# EAGLE design arm-pro-mini-tester (EAGLE 6.5.0)
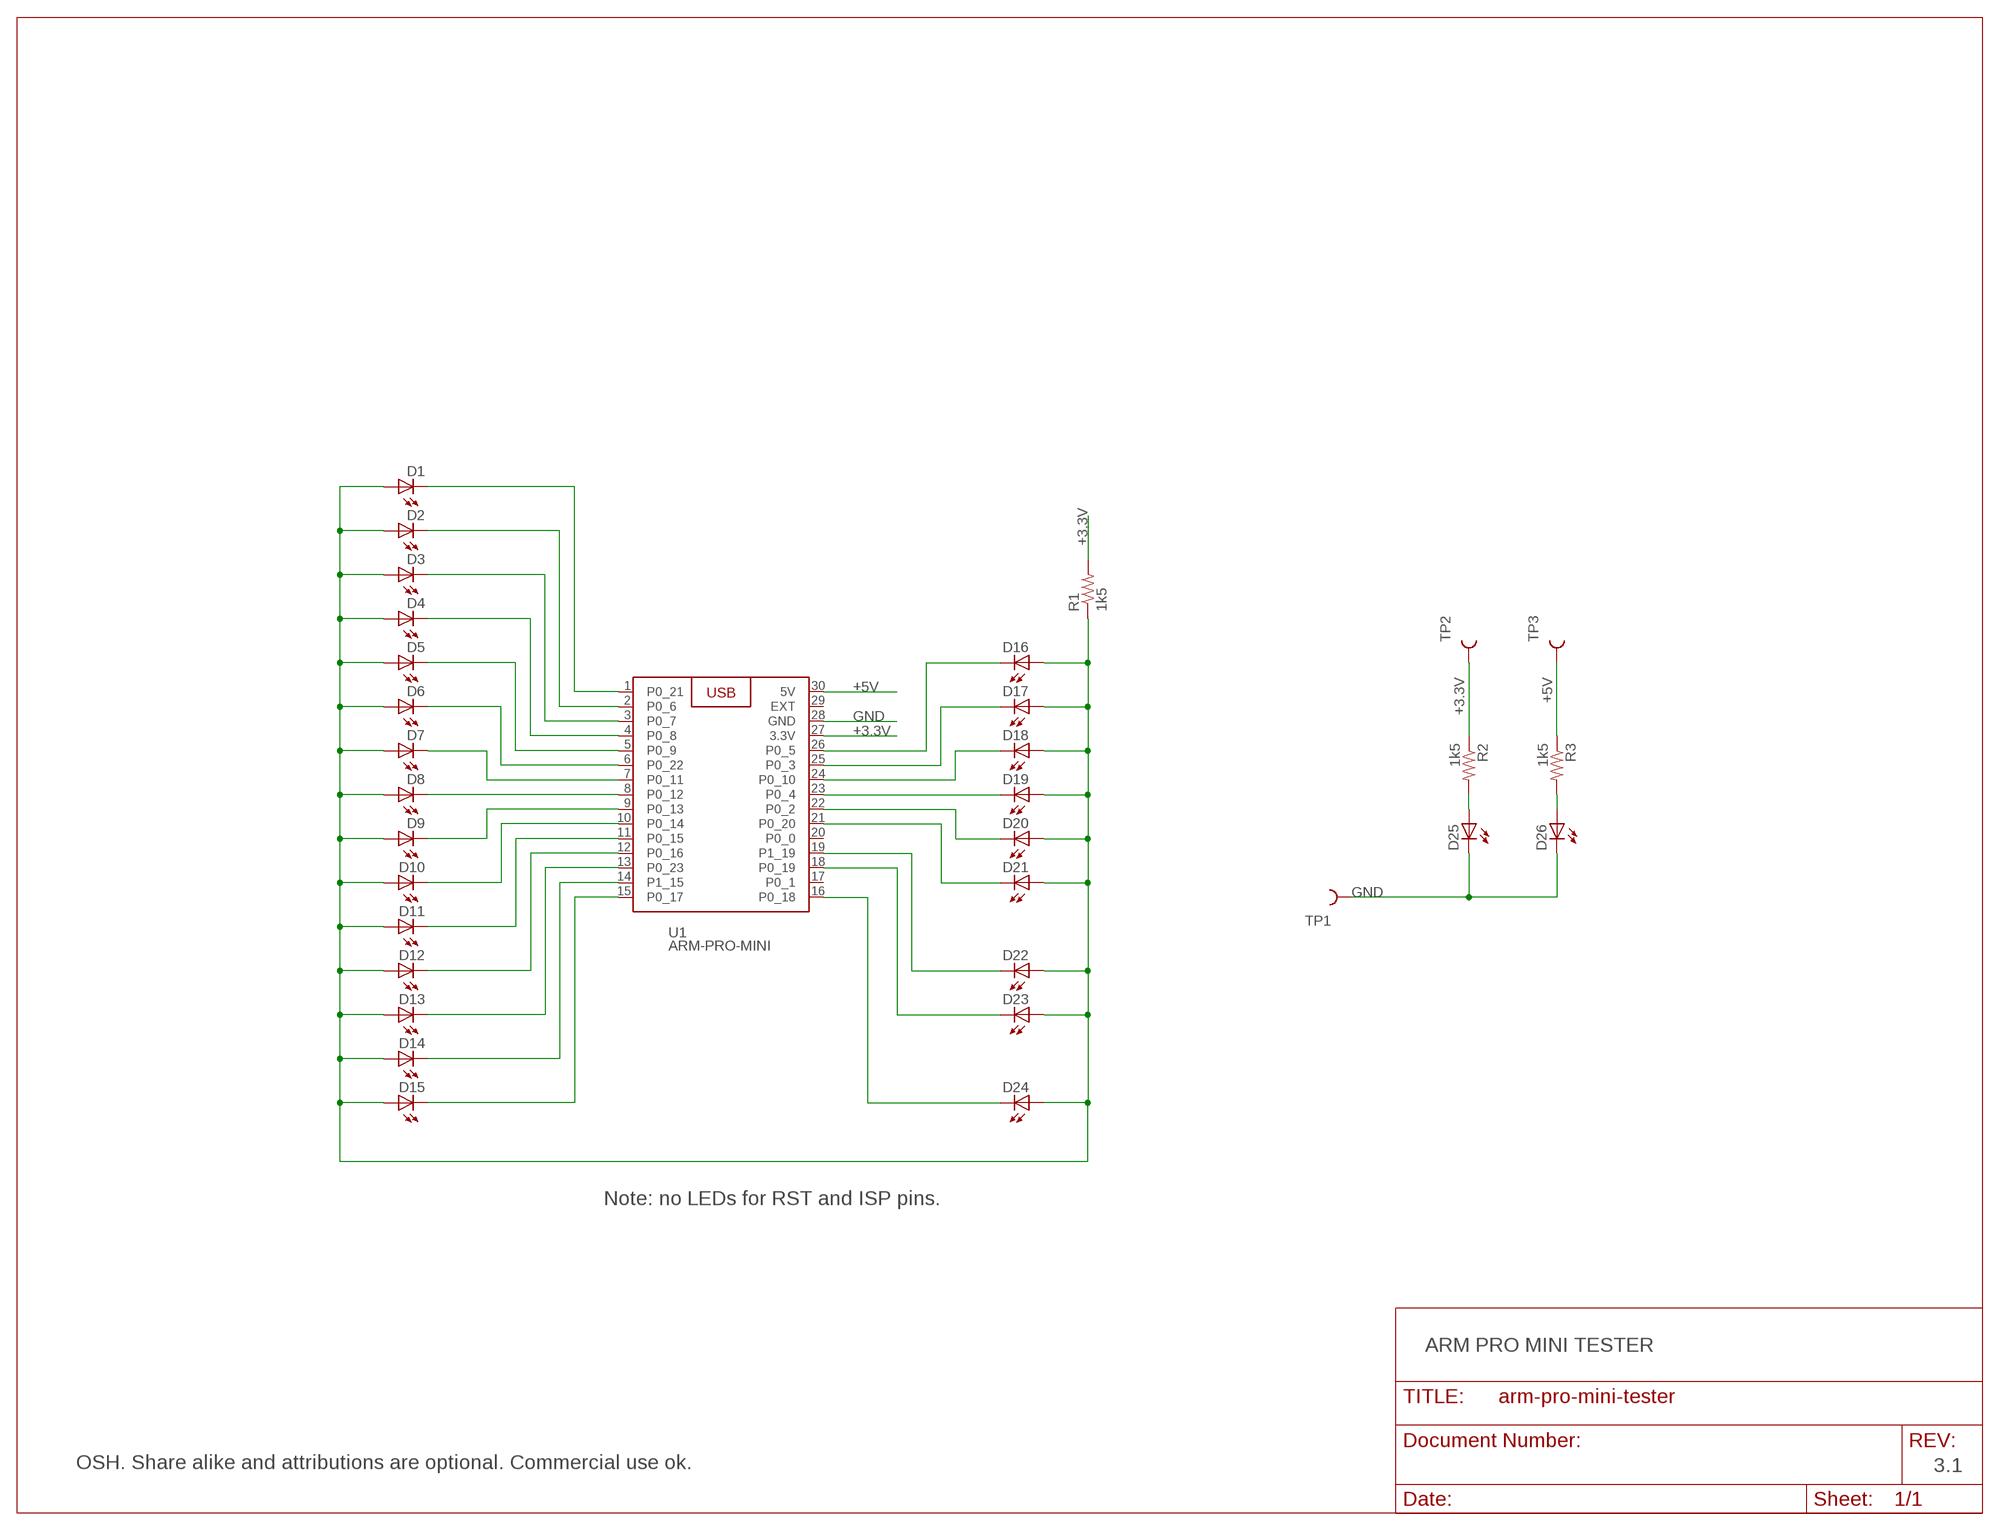
[diagram p0: schematic, sheet 1]

## Parts
D1  LED  [LED0603]
D2  LED  [LED0603]
D3  LED  [LED0603]
D4  LED  [LED0603]
D5  LED  [LED0603]
D6  LED  [LED0603]
D7  LED  [LED0603]
D8  LED  [LED0603]
D9  LED  [LED0603]
D10  LED  [LED0603]
D11  LED  [LED0603]
D12  LED  [LED0603]
D13  LED  [LED0603]
D14  LED  [LED0603]
D15  LED  [LED0603]
D16  LED  [LED0603]
D17  LED  [LED0603]
D18  LED  [LED0603]
D19  LED  [LED0603]
D20  LED  [LED0603]
D21  LED  [LED0603]
D22  LED  [LED0603]
D23  LED  [LED0603]
D24  LED  [LED0603]
D25  LED  [LED0603]
D26  LED  [LED0603]
R1  1k5  R-US_R0603  [R0603]
R2  1k5  R-US_R0603  [R0603]
R3  1k5  R-US_R0603  [R0603]
TP1  TEST-POINT  [TEST-POINT]
TP2  TEST-POINT  [TEST-POINT]
TP3  TEST-POINT  [TEST-POINT]
U1  ARM-PRO-MINI  [ARM-PRO-MINI]

## Nets
+3.3V: R1.2 R2.1 TP2.A(TP) TP2.B(TP) U1.27(3.3V)
+5V: R3.1 TP3.A(TP) TP3.B(TP) U1.30(5V)
GND: D25.C D26.C TP1.A(TP) TP1.B(TP) U1.28(GND)
N$1: D1.C U1.1(P0_21)
N$2: D2.C U1.2(P0_6)
N$3: D3.C U1.3(P0_7)
N$4: D4.C U1.4(P0_8)
N$5: D5.C U1.5(P0_9)
N$6: D15.C U1.15(P0_17)
N$7: D14.C U1.14(P1_15)
N$8: D13.C U1.13(P0_23)
N$9: D12.C U1.12(P0_16)
N$10: D11.C U1.11(P0_15)
N$11: D10.C U1.10(P0_14)
N$12: D6.C U1.6(P0_22)
N$13: D7.C U1.7(P0_11)
N$14: D9.C U1.9(P0_13)
N$15: D8.C U1.8(P0_12)
N$16: D19.C U1.23(P0_4)
N$17: D24.C U1.16(P0_18)
N$19: D23.C U1.18(P0_19)
N$20: D22.C U1.19(P1_19)
N$22: D21.C U1.21(P0_20)
N$23: D20.C U1.22(P0_2)
N$24: D18.C U1.24(P0_10)
N$25: D17.C U1.25(P0_3)
N$26: D16.C U1.26(P0_5)
N$27: D1.A D2.A D3.A D4.A D5.A D6.A D7.A D8.A D9.A D10.A D11.A D12.A D13.A D14.A D15.A D16.A D17.A D18.A D19.A D20.A D21.A D22.A D23.A D24.A R1.1
N$29: D25.A R2.2
N$31: D26.A R3.2
Unconnected: U1.17(P0_1) U1.20(P0_0) U1.29(EXT)

## Notes on the sheet
- Note: no LEDs for RST and ISP pins.
- ARM PRO MINI TESTER
- OSH. Share alike and attributions are optional. Commercial use ok. | 3.1

## Library data of the parts
D1-D26 = arm-pro-mini-tester:LED
R1-R3 = resistor:R-US_: RESISTOR, American symbol
TP1-TP3 = arm-pro-mini-tester:TEST-POINT
U1 = arm-pro-mini-tester:ARM-PRO-MINI

## Net classes
1 power: width 0.254 mm

## Board
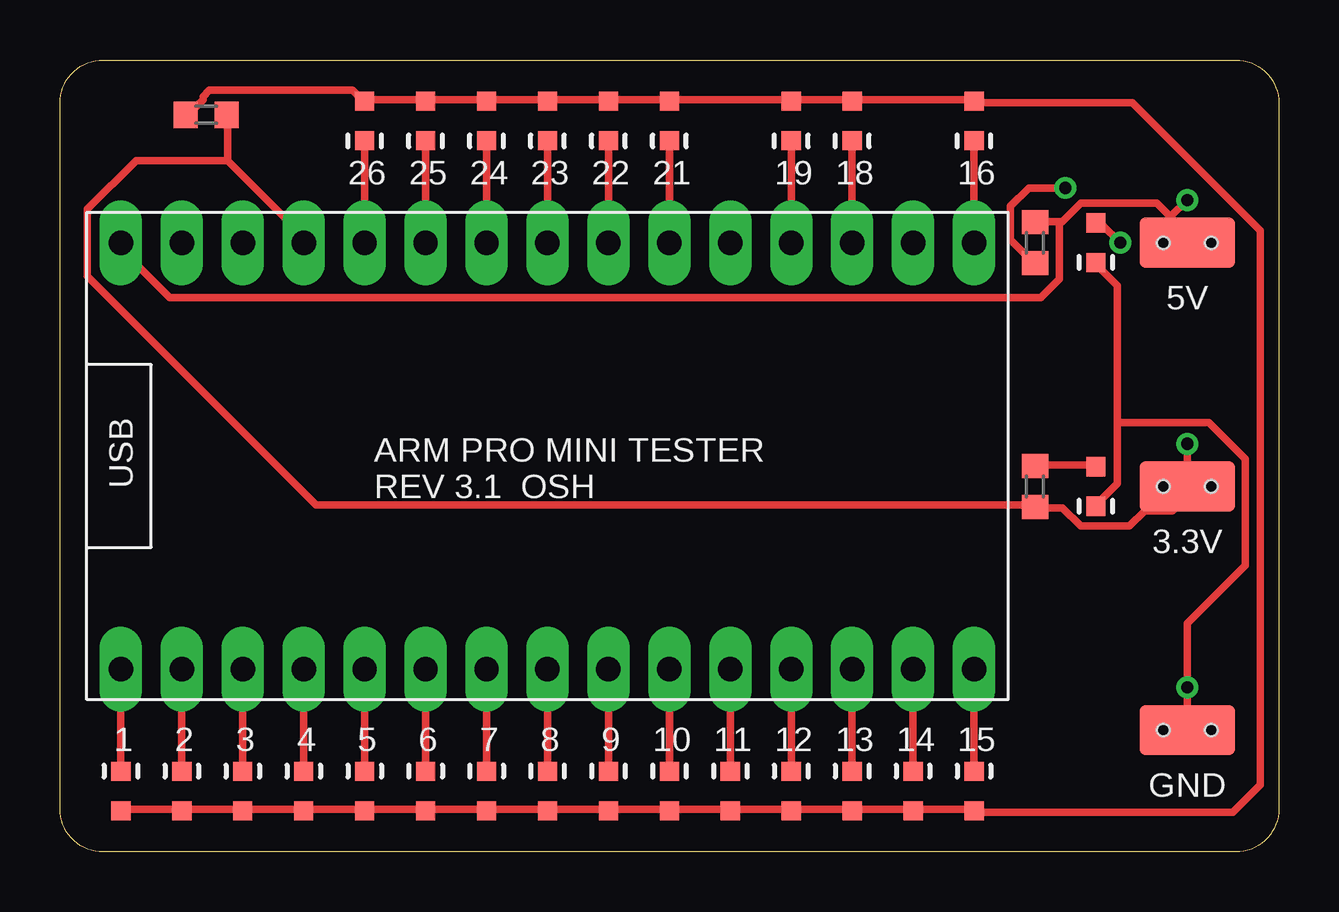
[diagram p1: board, top side]
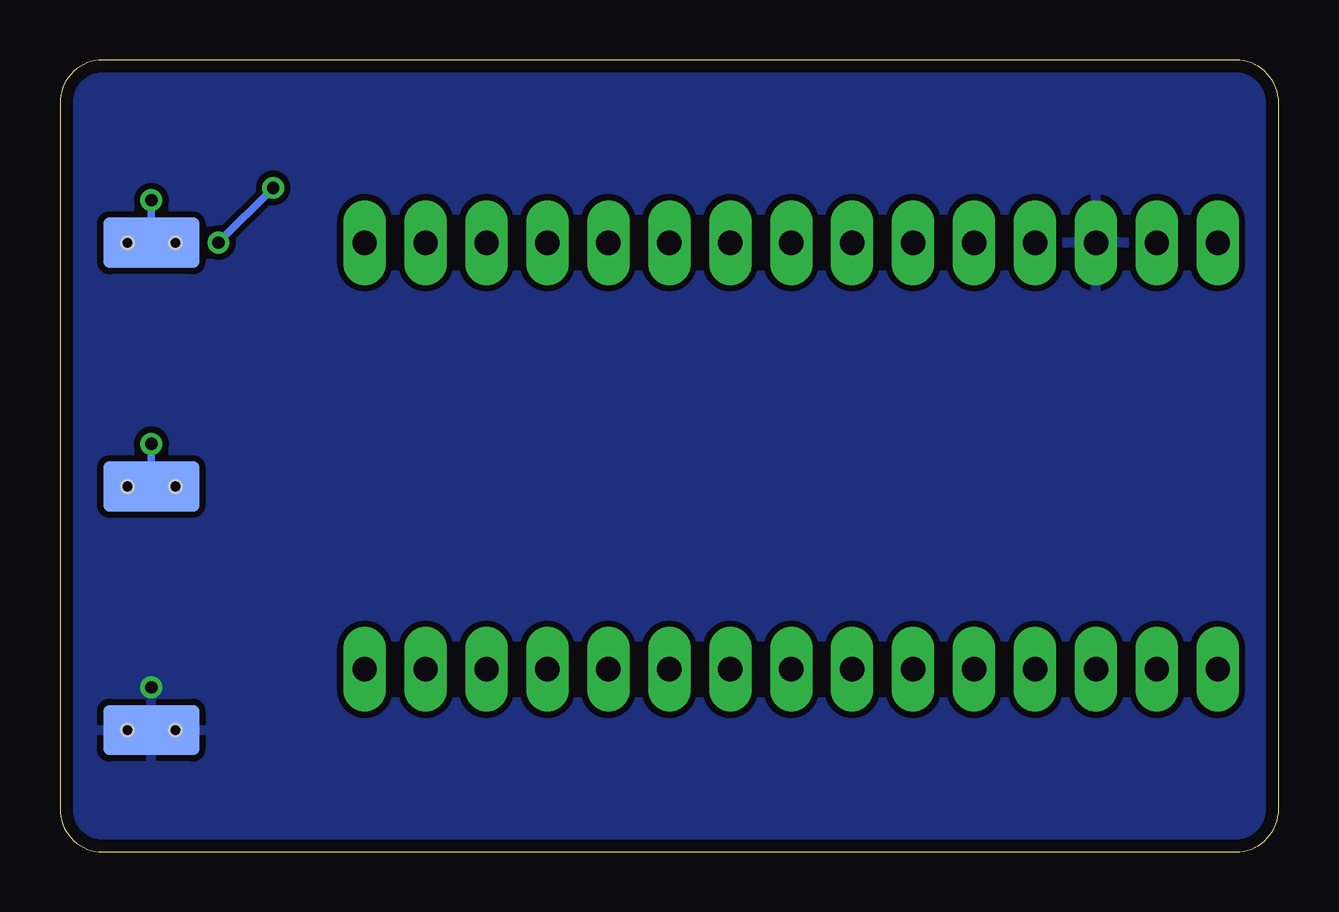
[diagram p2: board, bottom side, seen from below]

Size 50.8 x 33.02 mm. Coordinates in mm from the lower left corner, seen from the top.
Outline: 50.8,31.22 50.8,1.8 arc-90 49.02,0 1.8,0 arc-90 0,1.8 0,31.22 arc-90 1.8,33.02 49.02,33.02 arc-90 50.8,31.22
Copper layers (1*16): Top 0.035mm / dielectric 1.5mm / Bottom 0.035mm
Design rules "default *": minimum track width 12mil, minimum drill 20mil, track to track 10mil, track to pad 10mil, pad to pad 10mil, via to via 10mil, smd to smd 0mil, copper to edge 20mil, drill to drill 10mil, minimum pad ring 7mil, minimum via ring 8mil, stop-mask expansion 4mil, vias tented up to drill 20mil, thermal gap 10mil
tRestrict: area 45.3,21.8 to 48.6,24; area 45.1,11.7 to 48.9,13.8; area 45.2,1.9 to 48.9,3.8

### Footprints (pad centres in the part's own frame; a part is rotated, then mirrored left to right if it is on the bottom)
LED0603 = smd 0.8 x 0.8: A 0,-0.825; C 0,0.825
R0603 = smd 1 x 1.1: 1 -0.85,0; 2 0.85,0
TEST-POINT = smd 4 x 2.1: A 0,0 | smd 4 x 2.1 bottom: B 0,0 | hole 0.508: -1,0; 1,0
ARM-PRO-MINI = drill 1.016 pad 1.778 long: 1 -7.62,5.08; 2 -7.62,2.54; 3 -7.62,0; 4 -7.62,-2.54; 5 -7.62,-5.08; 6 -7.62,-7.62; 7 -7.62,-10.16; 8 -7.62,-12.7; 9 -7.62,-15.24; 10 -7.62,-17.78; 11 -7.62,-20.32; 12 -7.62,-22.86; 13 -7.62,-25.4; 14 -7.62,-27.94; 15 -7.62,-30.48; 16 10.16,-30.48; 17 10.16,-27.94; 18 10.16,-25.4; 19 10.16,-22.86; 20 10.16,-20.32; 21 10.16,-17.78; 22 10.16,-15.24; 23 10.16,-12.7; 24 10.16,-10.16; 25 10.16,-7.62; 26 10.16,-5.08; 27 10.16,-2.54; 28 10.16,0; 29 10.16,2.54; 30 10.16,5.08

### Placement (x,y rotation side)
D1  2.54,2.54 0 top
D2  5.08,2.54 0 top
D3  7.62,2.54 0 top
D4  10.16,2.54 0 top
D5  12.7,2.54 0 top
D6  15.24,2.54 0 top
D7  17.78,2.54 0 top
D8  20.32,2.54 0 top
D9  22.86,2.54 0 top
D10  25.4,2.54 0 top
D11  27.94,2.54 0 top
D12  30.48,2.54 0 top
D13  33.02,2.54 0 top
D14  35.56,2.54 0 top
D15  38.1,2.54 0 top
D16  12.7,30.48 180 top
D17  15.24,30.48 180 top
D18  17.78,30.48 180 top
D19  20.32,30.48 180 top
D20  22.86,30.48 180 top
D21  25.4,30.48 180 top
D22  30.48,30.48 180 top
D23  33.02,30.48 180 top
D24  38.1,30.48 180 top
D25  43.18,15.24 180 top
D26  43.18,25.4 180 top
R1  6.1,30.73 0 top
R2  40.64,15.24 90 top
R3  40.64,25.4 270 top
TP1  46.99,5.08 0 top
TP2  46.99,15.24 0 top
TP3  46.99,25.4 0 top
U1  7.62,15.24 90 top

### Tracks (layer width: path | path; a pad name or v marks a point on that pad's centre or on a via)
+3.3V  (via drill 0.51)
  Top 0.305: 6.99,28.83 6.99,30.73 R1.2 | 6.99,28.83 10.16,25.65 U1.27 | v46.99,17.02 TP2.B 46.99,14.86 46.35,14.22 45.21,14.22 44.58,13.59 42.55,13.59 41.78,14.35 40.64,14.35 R2.1 40.51,14.48 10.67,14.48 1.14,24 1.14,26.8 3.17,28.83 6.99,28.83
  Bottom 0.305: v46.99,17.02 TP2.B
+5V  (via drill 0.51)
  Top 0.305: 41.66,26.29 41.78,26.29 42.55,27.05 45.72,27.05 46.29,26.48 | 41.66,26.29 40.64,26.29 R3.1 | 46.29,26.48 46.99,25.78 TP3.B | U1.30 2.54,25.15 4.57,23.11 40.89,23.11 41.66,23.88 41.66,26.29 | 46.29,26.48 v46.99,27.18
  Bottom 0.305: v46.99,27.18 TP3.B
GND  (via drill 0.51)
  Top 0.305: TP1.B v46.99,6.86 46.99,9.53 49.4,11.94 49.4,16.38 47.88,17.91 44.07,17.91 | 44.07,17.91 44.07,23.62 43.18,24.51 D26.C | 44.07,17.91 44.07,15.37 43.18,14.48 D25.C
  pour Bottom: 0,0 0,33.02 50.8,33.02 50.8,0
N$1
  Top 0.305: U1.1 D1.C
N$2
  Top 0.305: U1.2 D2.C
N$3
  Top 0.305: U1.3 D3.C
N$4
  Top 0.305: U1.4 D4.C
N$5
  Top 0.305: U1.5 D5.C
N$6
  Top 0.305: U1.15 D15.C
N$7
  Top 0.305: U1.14 D14.C
N$8
  Top 0.305: U1.13 D13.C
N$9
  Top 0.305: U1.12 D12.C
N$10
  Top 0.305: U1.11 D11.C
N$11
  Top 0.305: U1.10 D10.C
N$12
  Top 0.305: U1.6 D6.C
N$13
  Top 0.305: U1.7 D7.C
N$14
  Top 0.305: U1.9 D9.C
N$15
  Top 0.305: U1.8 D8.C
N$16
  Top 0.305: U1.23 D19.C
N$17
  Top 0.305: U1.16 D24.C
N$19
  Top 0.305: U1.18 D23.C
N$20
  Top 0.305: U1.19 D22.C
N$22
  Top 0.305: U1.21 D21.C
N$23
  Top 0.305: U1.22 D20.C
N$24
  Top 0.305: U1.24 D18.C
N$25
  Top 0.305: U1.25 D17.C
N$26
  Top 0.305: U1.26 D16.C
N$27
  Top 0.305: R1.1 5.33,30.73 5.97,31.37 5.97,31.5 6.22,31.75 12.19,31.75 12.57,31.37 D16.A 12.7,31.37 15.24,31.37 D17.A 15.37,31.37 17.78,31.37 D18.A 17.91,31.37 20.32,31.37 D19.A 20.45,31.37 22.86,31.37 D20.A 22.99,31.37 25.4,31.37 D21.A 25.53,31.37 30.35,31.37 D22.A 30.48,31.37 33.02,31.37 D23.A 33.15,31.37 38.1,31.37 D24.A 38.23,31.24 44.7,31.24 50.04,25.91 50.04,2.79 48.9,1.65 38.23,1.65 D15.A 38.1,1.78 35.69,1.78 D14.A 35.56,1.78 33.15,1.78 D13.A 33.02,1.78 30.61,1.78 D12.A 30.48,1.78 28.07,1.78 D11.A 27.94,1.78 25.53,1.78 D10.A 25.4,1.78 22.99,1.78 D9.A 22.86,1.78 20.45,1.78 D8.A 20.32,1.78 17.91,1.78 D7.A 17.78,1.78 15.37,1.78 D6.A 15.24,1.78 12.83,1.78 D5.A 12.7,1.78 10.29,1.78 D4.A 10.16,1.78 7.75,1.78 D3.A 7.62,1.78 5.21,1.78 D2.A 5.08,1.78 2.54,1.78 D1.A
N$29
  Top 0.305: D25.A 43.18,16.13 40.64,16.13 R2.2
N$31  (via drill 0.51)
  Top 0.305: v44.2,25.4 43.43,26.16 43.18,26.16 D26.A | v41.91,27.69 40.39,27.69 39.62,26.92 39.62,25.53 40.64,24.51 R3.2
  Bottom 0.305: v41.91,27.69 v44.2,25.4

### Text on the board
tPlace: 26 | 25 | 24 | 23 | 22 | 21 | 19 | 18 | 16 | 5V | USB | ARM PRO MINI TESTER / REV 3.1 OSH | 3.3V | 1 | 2 | 3 | 4 | 5 | 6 | 7 | 8 | 9 | 10 | 11 | 12 | 13 | 14 | 15 | GND
Document: OSH. Share alike and attributions / are optional. Commercial use ok.